# Altium schematic sheet TOP.SchDoc
size A; SheetNumber: 1; SheetTotal: 4
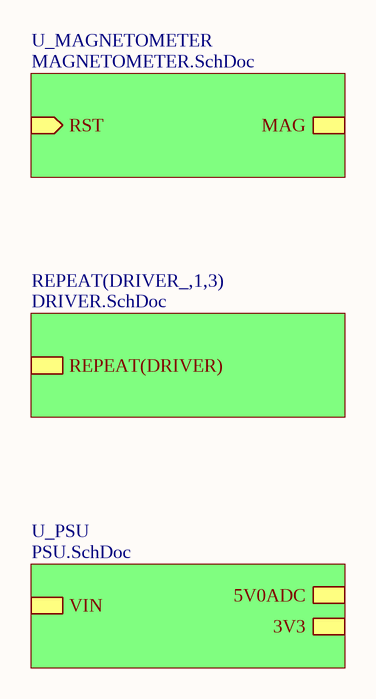
[diagram p0: TOP.SchDoc]

## Sub-sheets
REPEAT(DRIVER_,1,3) = DRIVER.SchDoc: REPEAT(DRIVER) (harness DRIVER)
U_MAGNETOMETER = MAGNETOMETER.SchDoc: RST (in), MAG (harness MAGNETOMETER)
U_PSU = PSU.SchDoc: VIN, 5V0ADC, 3V3